# Altium schematic sheet Sensors.SchDoc: CIRCUIT SENSORS
size A; DrawnBy: Diego Gomez Canales; DocumentNumber: SCH-2; Revision: 1.0; SheetNumber: 2; SheetTotal: 4
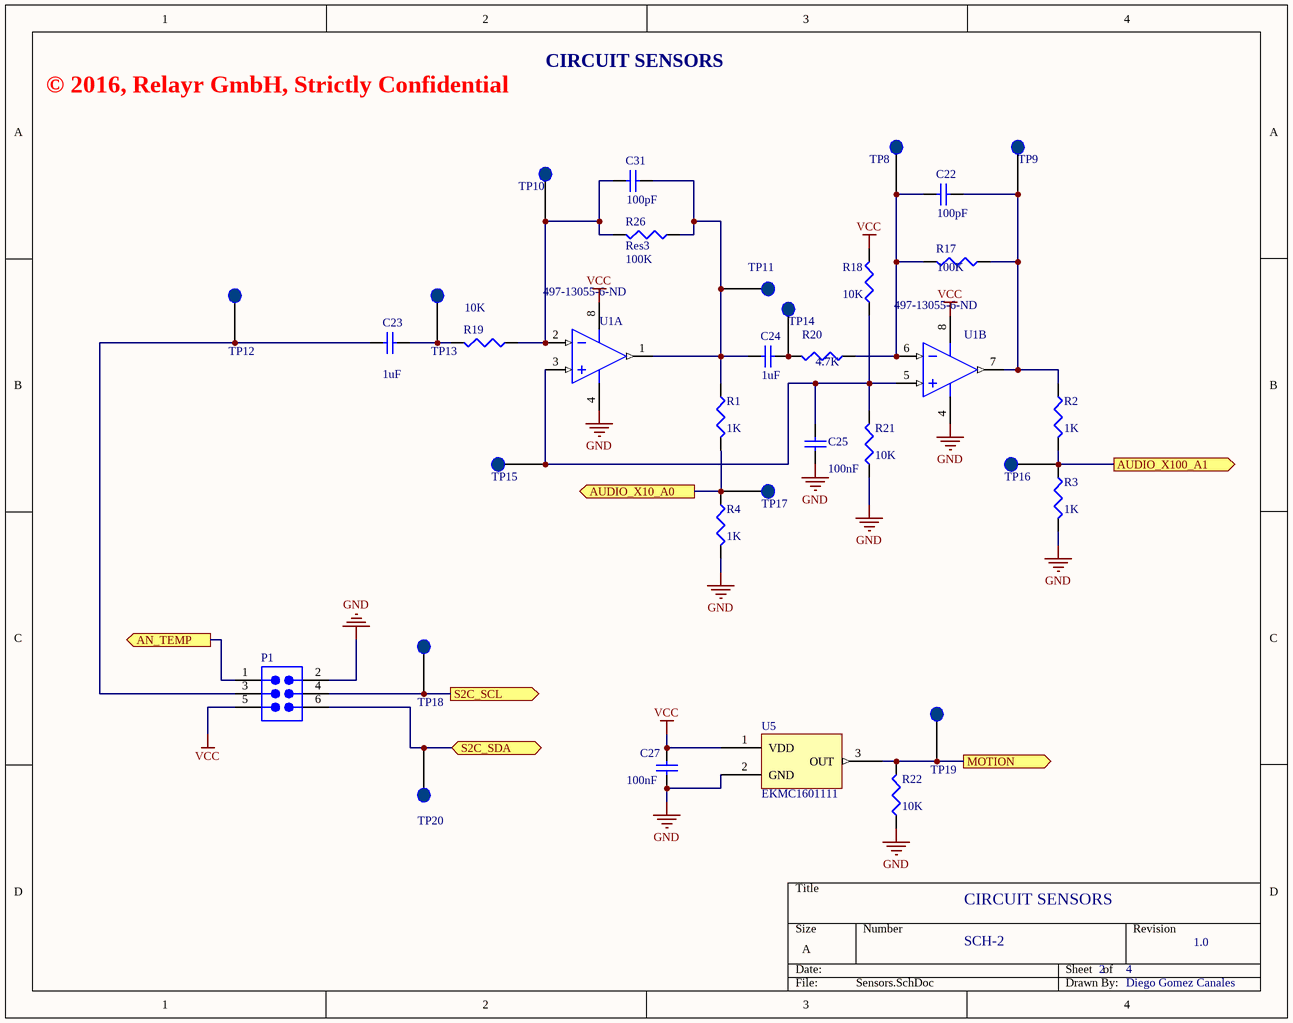
[diagram p0: Sensors.SchDoc]

## Parts
C22  value 100pF  [6-0805_N]  (hidden comment: Cap)
C23  value 1uF  [6-0805_N]  (hidden comment: Cap)
C24  value 1uF  [6-0805_N]  (hidden comment: Cap)
C25  value 100nF  [6-0805_N]  (hidden comment: Cap)
C27  value 100nF  [6-0805_N]  (hidden comment: Cap)
C31  value 100pF  [6-0805_N]  (hidden comment: Cap)
P1  SMTC-TSW-103-08-X-D  [SMTC-TSW-103-08-X-D]  (value not drawn)
R1  value 1K  [6-0805_N]  (hidden comment: Res3)
R2  value 1K  [6-0805_N]  (hidden comment: Res3)
R3  value 1K  [6-0805_N]  (hidden comment: Res3)
R4  value 1K  [6-0805_N]  (hidden comment: Res3)
R17  value 100K  [6-0805_N]  (hidden comment: Res3)
R18  value 10K  [6-0805_N]  (hidden comment: Res3)
R19  value 10K  [6-0805_N]  (hidden comment: Res3)
R20  value 4.7K  [6-0805_N]  (hidden comment: Res3)
R21  value 10K  [6-0805_N]  (hidden comment: Res3)
R22  value 10K  [6-0805_N]  (hidden comment: Res3)
R26  Res3  value 100K  [6-0805_N]
TP8  TEST_POINT  [TP]  (value not drawn)
TP9  TEST_POINT  [TP]  (value not drawn)
TP10  TEST_POINT  [TP]  (value not drawn)
TP11  TEST_POINT  [TP]  (value not drawn)
TP12  TEST_POINT  [TP]  (value not drawn)
TP13  TEST_POINT  [TP]  (value not drawn)
TP14  TEST_POINT  [TP]  (value not drawn)
TP15  TEST_POINT  [TP]  (value not drawn)
TP16  TEST_POINT  [TP]  (value not drawn)
TP17  TEST_POINT  [TP]  (value not drawn)
TP18  TEST_POINT  [TP]  (value not drawn)
TP19  TEST_POINT  [TP]  (value not drawn)
TP20  TEST_POINT  [TP]  (value not drawn)
U1  Supplier Part Number 1: 497-13055-6-ND  [ONSC-MICRO-8-846A-02_H_V]  (hidden comment: ONSC-LM358_NCV2904-8)  (parts A,B of 2)
U5  EKMC1601111  [EKMC1601111]

## Ports
AN_TEMP (out), AUDIO_X10_A0 (out), AUDIO_X100_A1 (out), MOTION (out), S2C_SCL (out), S2C_SDA (bidir)

## Nets
GND: C25.1 C27.1 P1.2 R3.2 R4.2 R21.1 R22.1 U1.4(VEE/GND) U5.2(GND)
VCC: C27.2 P1.5 R18.2 U1.8(VCC) U5.1(VDD)
AN_TEMP: P1.1 ; port AN_TEMP
AUDIO_X10_A0: R1.2 R4.1 TP17.1 ; port AUDIO_X10_A0
AUDIO_X100_A1: R2.2 R3.1 TP16.1 ; port AUDIO_X100_A1
MOTION: R22.2 TP19.1 U5.3(OUT) ; port MOTION
S2C_SCL: P1.4 TP18.1 ; port S2C_SCL
S2C_SDA: P1.6 TP20.1 ; port S2C_SDA
NetC22_1: C22.1 R2.1 R17.1 TP9.1 U1.7(OUTB)
NetC22_2: C22.2 R17.2 R20.1 TP8.1 U1.6(INB-)
NetC23_1: C23.1 R19.2 TP13.1
NetC23_2: C23.2 P1.3 TP12.1
NetC24_1: C24.1 R20.2 TP14.1
NetC24_2: C24.2 C31.1 R1.1 R26.1 TP11.1 U1.1(OUTA)
NetC25_2: C25.2 R18.1 R21.2 TP15.1 U1.3(INA+) U1.5(INB+)
NetC31_2: C31.2 R19.1 R26.2 TP10.1 U1.2(INA-)

## Notes on the sheet
- © 2016, Relayr GmbH, Strictly Confidential
- CIRCUIT SENSORS

## Library data of the parts
C22-C25 C27 C31 = Cap: Capacitor; Published: 8-Jun-2000; LatestRevisionDate: 17-Jul-2002; LatestRevisionNote: Re-released for DXP Platform.; PackageReference: RAD-0.3; Publisher: Altium Limited; PackageDescription: Radial Cap, Thru-Hole; 2 Leads; 0.3 in Pin Spacing; Supplier 1: Digi-Key
  C22 C31: Supplier Part Number 1: 732-8027-2-ND
  C23: Supplier Part Number 1: 311-1365-2-ND
  C24: Supplier Part Number 1: 311-1365-1-ND
  C25 C27: Supplier Part Number 1: 399-1170-2-ND
R1-R4 R17-R22 R26 = Res3: Resistor; Published: 8-Jun-2000; LatestRevisionDate: 29-May-2009; LatestRevisionNote: IPC-7351 Footprint Added.; PackageReference: J1-0603; Publisher: Altium Limited; PackageDescription: Chip Resistor; Supplier 1: Digi-Key
  R1-R4: Supplier Part Number 1: CRS0805-FX-1001ELFCT-ND
  R17 R26: Supplier Part Number 1: RPC0805JT100KCT-ND
  R18 R19 R21 R22: Supplier Part Number 1: RPC0805JT10K0CT-ND
  R20: Supplier Part Number 1: 311-4.70KCRTR-ND
TP8-TP20 = TEST_POINT: Point of test to manufacturing
U5 = EKMC1601111: EKMC1601111 Panasonic PIR Motion Detection Module; Supplier 1: Digi-Key; Supplier Part Number 1: 255-3074-ND
P1 = SMTC-TSW-103-08-X-D: Supplier 1: Digi-Key; Supplier Part Number 1: SAM1036-03-ND
U1 = ONSC-LM358_NCV2904-8: Supplier 1: Digi-Key